# EAGLE schematic Qi-Receiver1.1 (EAGLE 9.6.2)
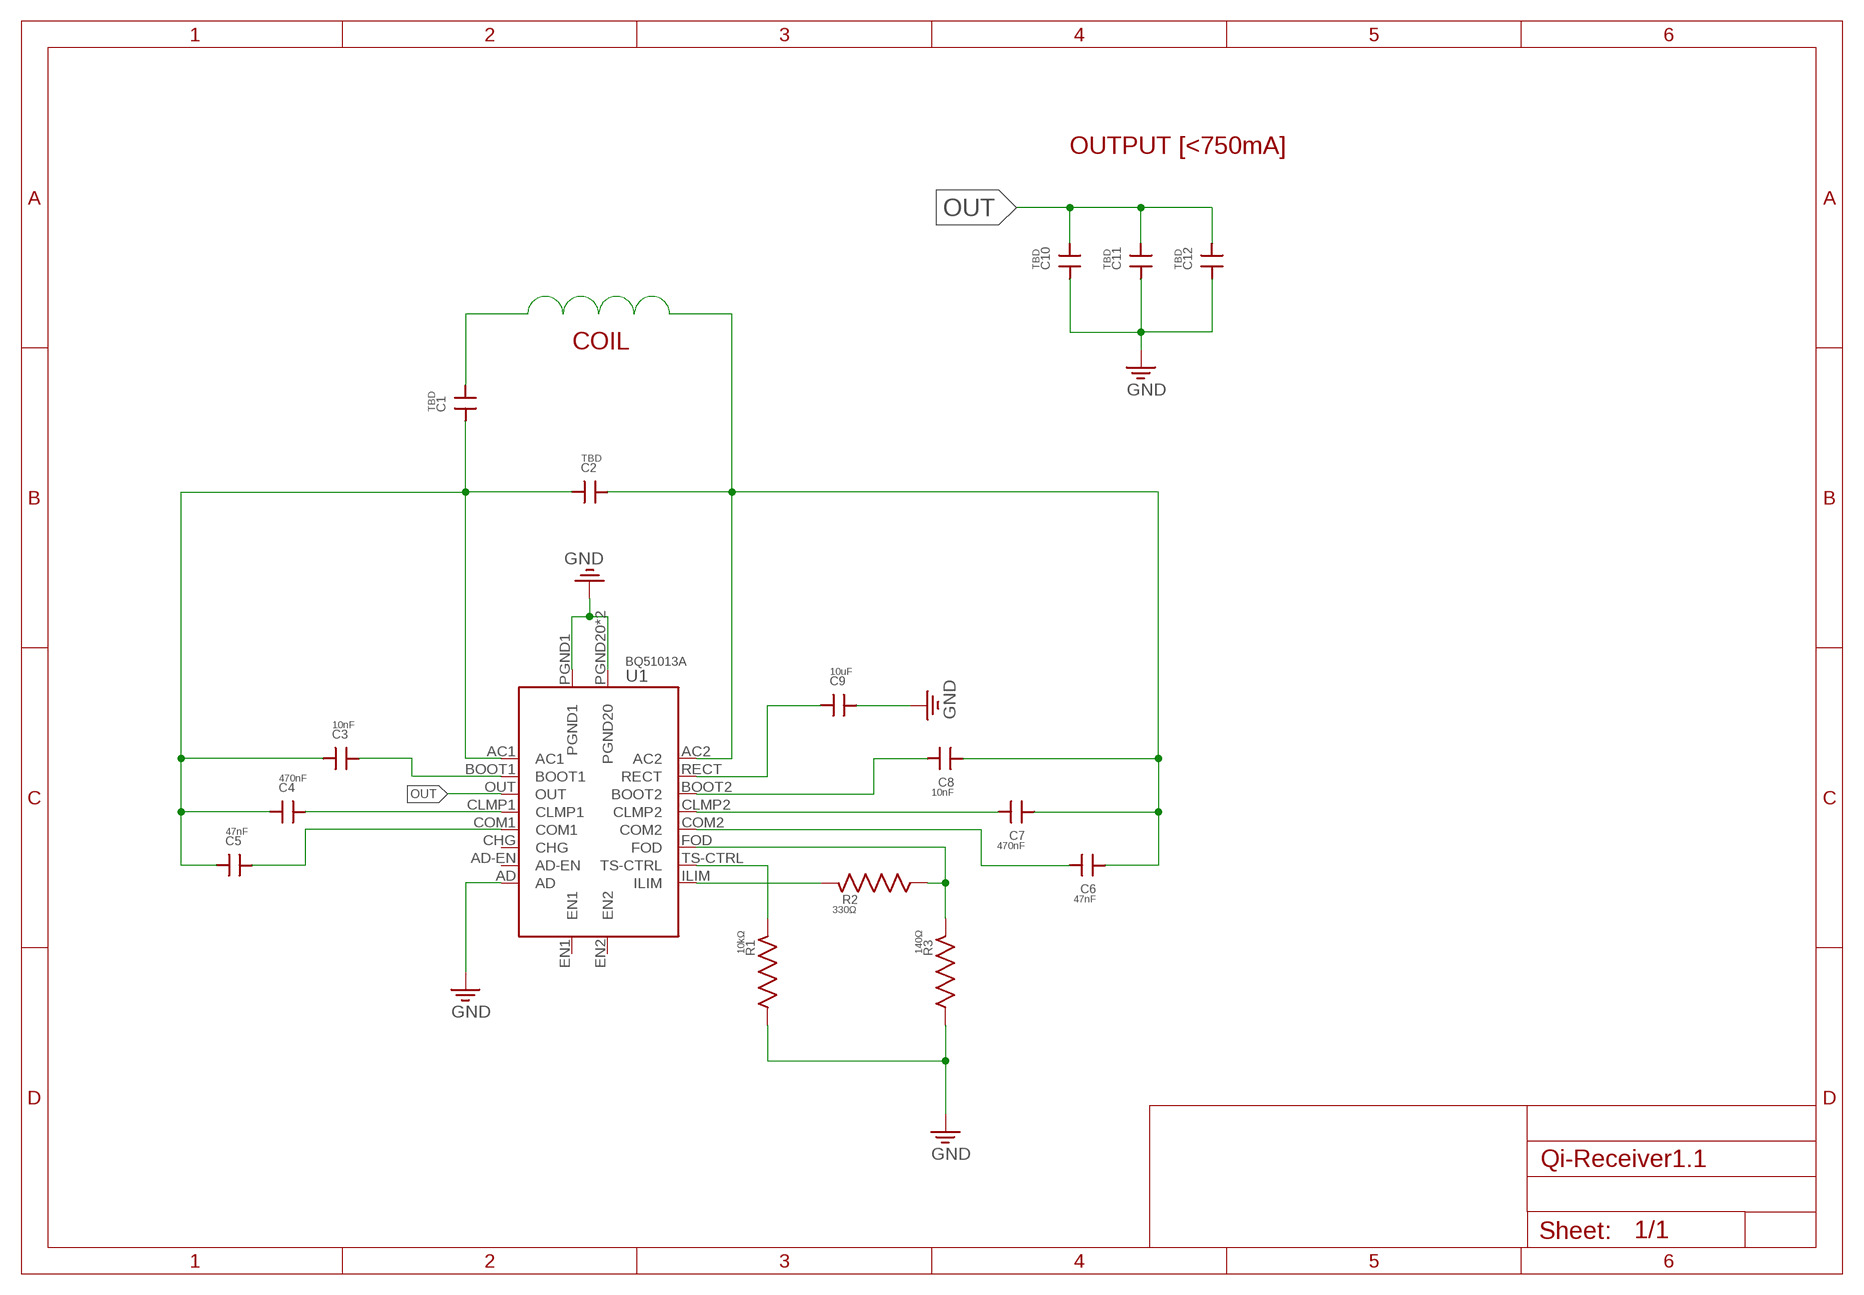
[diagram p0: schematic, sheet 1]

## Parts
C1  TBD  0402-CAP  [0402-SMT]
C2  TBD  0402-CAP  [0402-SMT]
C3  10nF  0402-CAP  [0402-SMT]
C4  470nF  0402-CAP  [0402-SMT]
C5  47nF  0402-CAP  [0402-SMT]
C6  47nF  0402-CAP  [0402-SMT]
C7  470nF  0402-CAP  [0402-SMT]
C8  10nF  0402-CAP  [0402-SMT]
C9  10uF  0402-CAP  [0402-SMT]
C10  TBD  0402-CAP  [0402-SMT]
C11  TBD  0402-CAP  [0402-SMT]
C12  TBD  0402-CAP  [0402-SMT]
R1  10kΩ  0402-RES  [0402-SMT]
R2  330Ω  0402-RES  [0402-SMT]
R3  140Ω  0402-RES  [0402-SMT]
U1  BQ51013A  [BQ51013A]
U$1  GND  (no package)
U$2  GND  (no package)
U$4  GND  (no package)
U$5  GND  (no package)
U$8  GND  (no package)

## Nets
AC1: C1.P$1 C2.P$1 C3.P$1 C4.P$1 C5.P$1 U1.AC1
AC2: C1.P$2 C2.P$2 C6.P$1 C7.P$1 C8.P$1 U1.AC2
BOOT1: C3.P$2 U1.BOOT1
BOOT2: C8.P$2 U1.BOOT2
CLMP1: C4.P$2 U1.CLMP1
CLMP2: C7.P$2 U1.CLMP2
COM1: C5.P$2 U1.COM1
COM2: C6.P$2 U1.COM2
FOD: R2.P$1 R3.P$2 U1.FOD
GND: C9.P$2 C10.P$1 C11.P$1 C12.P$1 R1.P$1 R3.P$1 U1.AD U1.PGND1 U1.PGND20 U1.THERM(PGND20) U$1.P$1 U$2.P$1 U$4.P$1 U$5.P$1 U$8.P$1
ILIM: R2.P$2 U1.ILIM
N$1: R1.P$2 U1.TS-CTRL
OUT: C10.P$2 C11.P$2 C12.P$2 U1.OUT
RECT: C9.P$1 U1.RECT
Unconnected: U1.AD-EN U1.CHG U1.EN1 U1.EN2

## Notes on the sheet
- OUTPUT [<750mA]
- COIL

## Library data of the parts
C1-C12 = Qi_Charger:0402-CAP
R1-R3 = Qi_Charger:0402-RES
U1 = Qi_Charger:BQ51013A: BQ51013A ~ Texas Intruments Qi Wireless Receiver
U$1 U$2 U$4 U$5 U$8 = Qi_Charger:GND